# EAGLE design Laser Centraal (EAGLE 9.3.2)
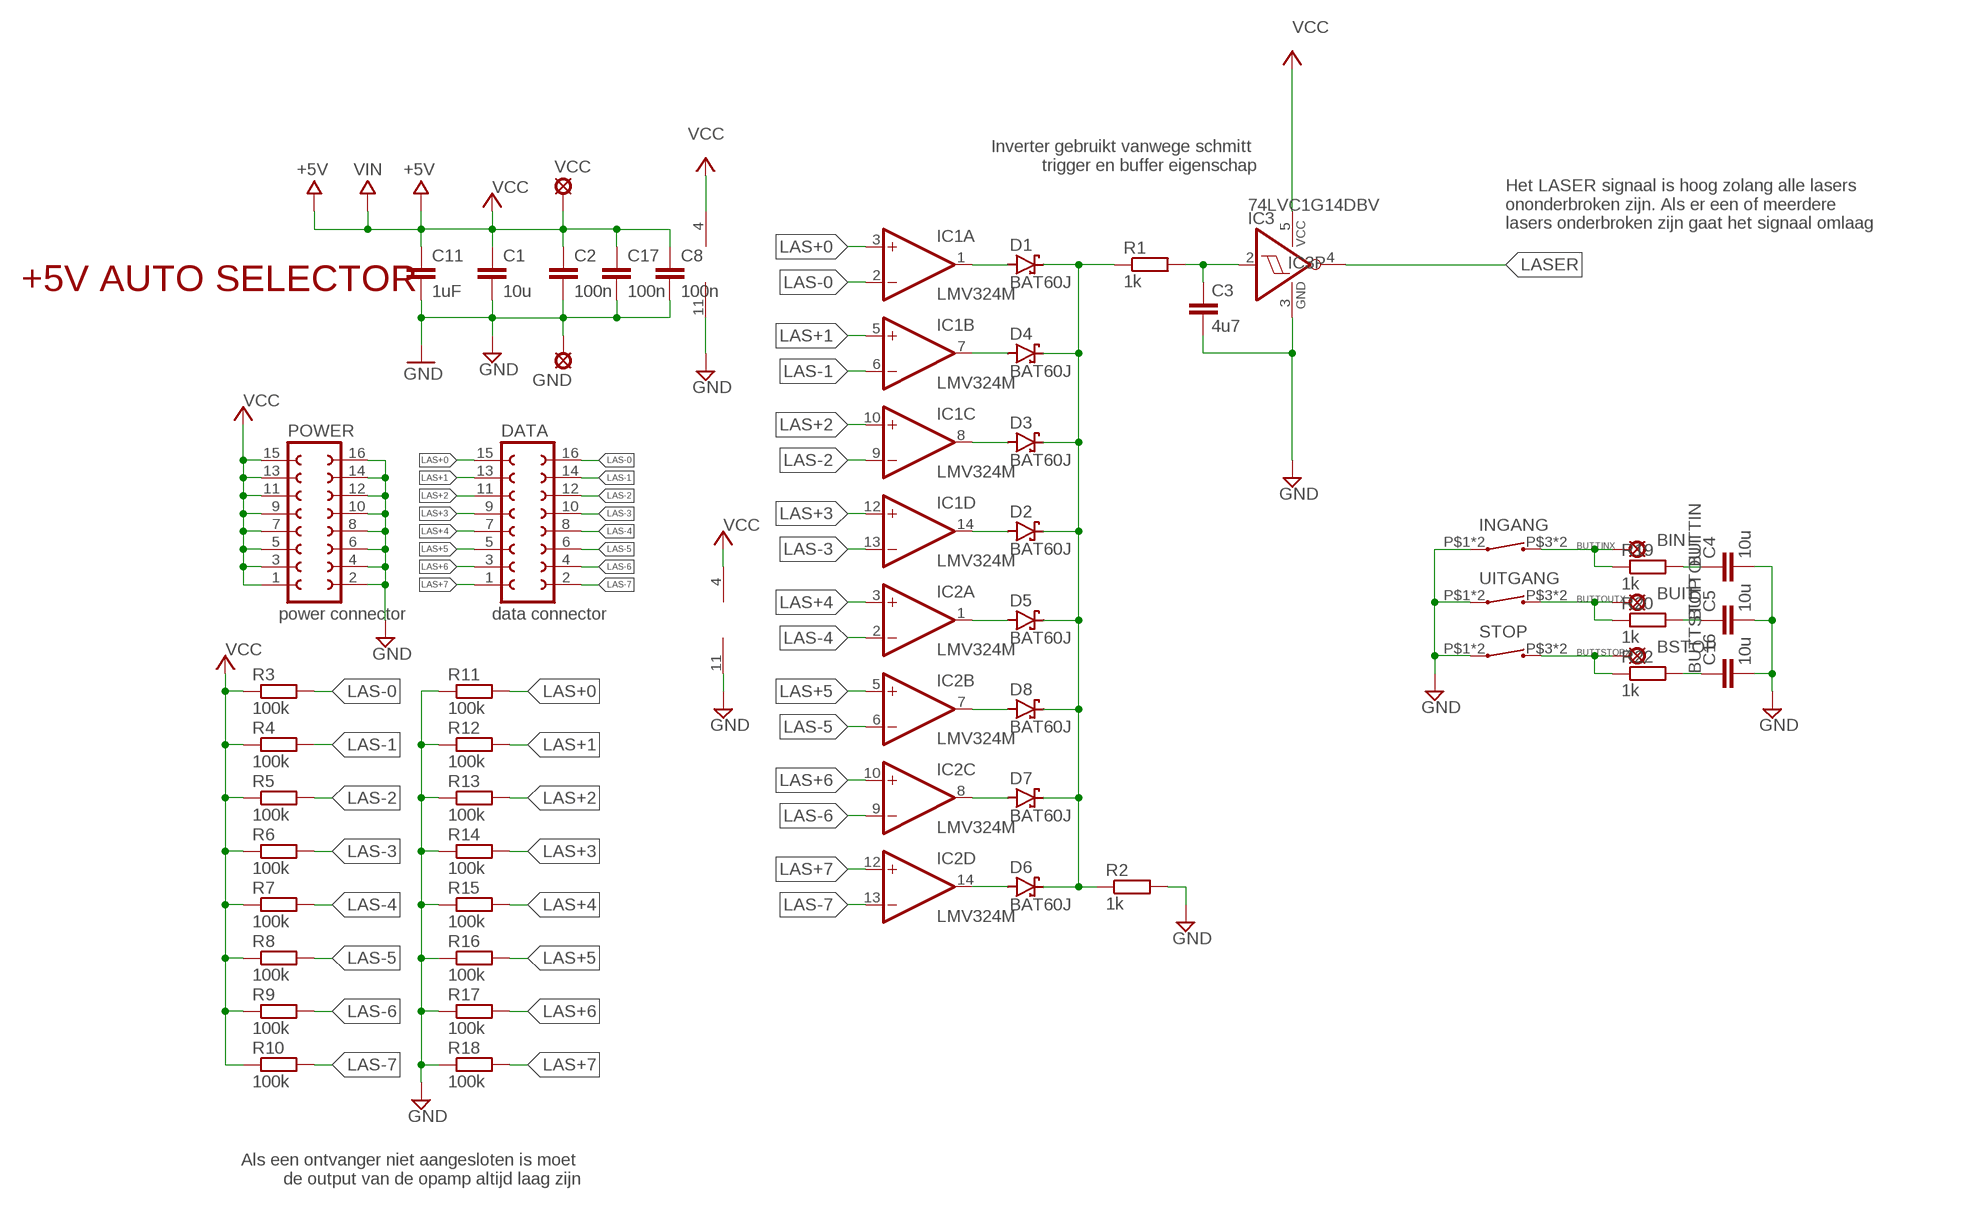
[diagram p0: schematic, sheet 1, part 1 of 2]
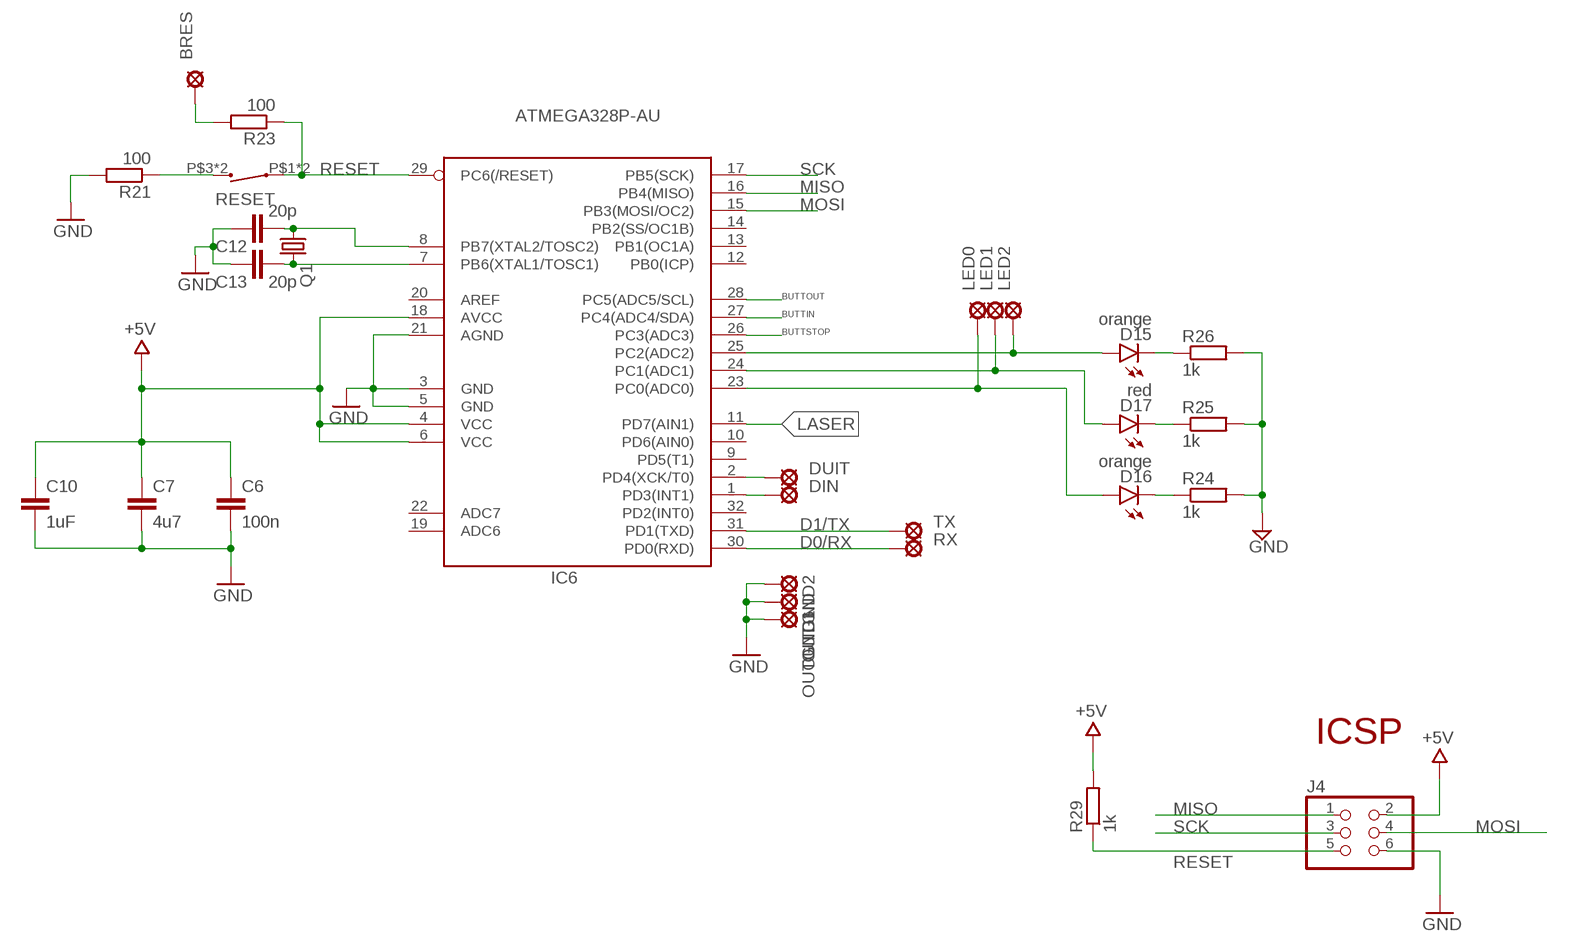
[diagram p1: schematic, sheet 1, part 2 of 2]

## Parts
BIN  LSP10  [LSP10]
BRES  LSP10  [LSP10]
BSTOP  LSP10  [LSP10]
BUIT  LSP10  [LSP10]
C1  10u  C-EUC0805  [C0805]
C2  100n  C-EUC0805  [C0805]
C3  4u7  C-EUC0805  [C0805]
C4  10u  C-EUC0805  [C0805]
C5  10u  C-EUC0805  [C0805]
C6  100n  C-EUC0805  [C0805]
C7  4u7  C-EUC0805  [C0805]
C8  100n  C-EUC0805  [C0805]
C10  1uF  C-EUC0805  [C0805]
C11  1uF  C-EUC0805  [C0805]
C12  20p  C-EUC0805  [C0805]
C13  20p  C-EUC0805  [C0805]
C16  10u  C-EUC0805  [C0805]
C17  100n  C-EUC0805  [C0805]
D1  BAT60J  [SOD323_ST]
D2  BAT60J  [SOD323_ST]
D3  BAT60J  [SOD323_ST]
D4  BAT60J  [SOD323_ST]
D5  BAT60J  [SOD323_ST]
D6  BAT60J  [SOD323_ST]
D7  BAT60J  [SOD323_ST]
D8  BAT60J  [SOD323_ST]
D15  orange  LEDCHIP-LED0805  [CHIP-LED0805]
D16  orange  LEDCHIP-LED0805  [CHIP-LED0805]
D17  red  LEDCHIP-LED0805  [CHIP-LED0805]
DATA  FE08-2  [FE08-2]
DIN  LSP10  [LSP10]
DUIT  LSP10  [LSP10]
GND  LSP10  [LSP10]
IC1  LMV324M  [SO14]
IC2  LMV324M  [SO14]
IC3  74LVC1G14DBV  [SOT23-5]
IC6  ATMEGA328P-AU  ATMEGA328P-32AU  [TQFP32-08]
INGANG  BRIGHTTSA061G100-250_SWITCH  [BRIGHTTSA061G100-250]
J4  0114_PH254-203DF118A00V  [2X03]
LED0  LSP10  [LSP10]
LED1  LSP10  [LSP10]
LED2  LSP10  [LSP10]
OUTGND  LSP10  [LSP10]
OUTGND1  LSP10  [LSP10]
OUTGND2  LSP10  [LSP10]
POWER  FE08-2  [FE08-2]
Q1  CRYSTALHC49U70  [HC49U70]
R1  1k  R-EU_R0805  [R0805]
R2  1k  R-EU_R0805  [R0805]
R3  100k  R-EU_R0805  [R0805]
R4  100k  R-EU_R0805  [R0805]
R5  100k  R-EU_R0805  [R0805]
R6  100k  R-EU_R0805  [R0805]
R7  100k  R-EU_R0805  [R0805]
R8  100k  R-EU_R0805  [R0805]
R9  100k  R-EU_R0805  [R0805]
R10  100k  R-EU_R0805  [R0805]
R11  100k  R-EU_R0805  [R0805]
R12  100k  R-EU_R0805  [R0805]
R13  100k  R-EU_R0805  [R0805]
R14  100k  R-EU_R0805  [R0805]
R15  100k  R-EU_R0805  [R0805]
R16  100k  R-EU_R0805  [R0805]
R17  100k  R-EU_R0805  [R0805]
R18  100k  R-EU_R0805  [R0805]
R19  1k  R-EU_R0805  [R0805]
R20  1k  R-EU_R0805  [R0805]
R21  100  R-EU_R0805  [R0805]
R22  1k  R-EU_R0805  [R0805]
R23  100  R-EU_R0805  [R0805]
R24  1k  R-EU_R0805  [R0805]
R25  1k  R-EU_R0805  [R0805]
R26  1k  R-EU_R0805  [R0805]
R29  1k  R-EU_R0805  [R0805]
RESET  BRIGHTTSA061G100-250_SWITCH  [BRIGHTTSA061G100-250]
RX  LSP10  [LSP10]
STOP  BRIGHTTSA061G100-250_SWITCH  [BRIGHTTSA061G100-250]
TX  LSP10  [LSP10]
UITGANG  BRIGHTTSA061G100-250_SWITCH  [BRIGHTTSA061G100-250]
VCC  LSP10  [LSP10]

## Nets
BUTTIN: C4.1 IC6.27(PC4(ADC4/SDA)) R19.2
BUTTINX: BIN.MP INGANG.P$3 INGANG.P$4 R19.1
BUTTOUT: C5.1 IC6.28(PC5(ADC5/SCL)) R20.2
BUTTOUTX: BUIT.MP R20.1 UITGANG.P$3 UITGANG.P$4
BUTTSTOP: C16.1 IC6.26(PC3(ADC3)) R22.2
BUTTSTOPX: BSTOP.MP R22.1 STOP.P$3 STOP.P$4
D0/RX: IC6.30(PD0(RXD)) RX.MP
D1/TX: IC6.31(PD1(TXD)) TX.MP
GND: C1.2 C2.2 C3.2 C4.2 C5.2 C6.2 C7.2 C8.2 C10.2 C11.2 C12.1 C13.1 C16.2 C17.2 GND.MP IC1.11(P:V-) IC2.11(P:V-) IC3.3(GND) IC6.3(GND) IC6.5(GND) IC6.21(AGND) INGANG.P$1 INGANG.P$2 J4.6 OUTGND1.MP OUTGND2.MP OUTGND.MP POWER.2 POWER.4 POWER.6 POWER.8 POWER.10 POWER.12 POWER.14 POWER.16 R2.2 R11.1 R12.1 R13.1 R14.1 R15.1 R16.1 R17.1 R18.1 R21.2 R24.2 R25.2 R26.2 STOP.P$1 STOP.P$2 UITGANG.P$1 UITGANG.P$2
LAS+0: DATA.15 IC1.3(A:+IN) R11.2
LAS+1: DATA.13 IC1.5(B:+IN) R12.2
LAS+2: DATA.11 IC1.10(C:+IN) R13.2
LAS+3: DATA.9 IC1.12(D:+IN) R14.2
LAS+4: DATA.7 IC2.3(A:+IN) R15.2
LAS+5: DATA.5 IC2.5(B:+IN) R16.2
LAS+6: DATA.3 IC2.10(C:+IN) R17.2
LAS+7: DATA.1 IC2.12(D:+IN) R18.2
LAS-0: DATA.16 IC1.2(A:-IN) R3.2
LAS-1: DATA.14 IC1.6(B:-IN) R4.2
LAS-2: DATA.12 IC1.9(C:-IN) R5.2
LAS-3: DATA.10 IC1.13(D:-IN) R6.2
LAS-4: DATA.8 IC2.2(A:-IN) R7.2
LAS-5: DATA.6 IC2.6(B:-IN) R8.2
LAS-6: DATA.4 IC2.9(C:-IN) R9.2
LAS-7: DATA.2 IC2.13(D:-IN) R10.2
LASER: IC3.4(O) IC6.11(PD7(AIN1))
MISO [small]: IC6.16(PB4(MISO)) J4.1
MOSI [small]: IC6.15(PB3(MOSI/OC2)) J4.4
N$1: D1.A IC1.1(A:OUT)
N$2: D4.A IC1.7(B:OUT)
N$3: D3.A IC1.8(C:OUT)
N$4: D2.A IC1.14(D:OUT)
N$5: D5.A IC2.1(A:OUT)
N$6: D8.A IC2.7(B:OUT)
N$7: D7.A IC2.8(C:OUT)
N$8: D6.A IC2.14(D:OUT)
N$9: D1.C D2.C D3.C D4.C D5.C D6.C D7.C D8.C R1.1 R2.1
N$10: C3.1 IC3.2(I) R1.2
N$11: C13.2 IC6.7(PB6(XTAL1/TOSC1)) Q1.2
N$12: D16.C R24.1
N$13: D17.A IC6.24(PC1(ADC1)) LED1.MP
N$14: D15.C R26.1
N$15: R21.1 RESET.P$3 RESET.P$4
N$16: D16.A IC6.23(PC0(ADC0)) LED0.MP
N$17: C12.2 IC6.8(PB7(XTAL2/TOSC2)) Q1.1
N$18: BRES.MP R23.2
N$20: DUIT.MP IC6.2(PD4(XCK/T0))
N$21: D17.C R25.1
N$22: D15.A IC6.25(PC2(ADC2)) LED2.MP
N$23: DIN.MP IC6.1(PD3(INT1))
RESET: IC6.29(PC6(/RESET)) J4.5 R23.1 R29.1 RESET.P$1 RESET.P$2
SCK [small]: IC6.17(PB5(SCK)) J4.3
VCC: C1.1 C2.1 C6.1 C7.1 C8.1 C10.1 C11.1 C17.1 IC1.4(P:V+) IC2.4(P:V+) IC3.5(VCC) IC6.4(VCC) IC6.6(VCC) IC6.18(AVCC) J4.2 POWER.1 POWER.3 POWER.5 POWER.7 POWER.9 POWER.11 POWER.13 POWER.15 R3.1 R4.1 R5.1 R6.1 R7.1 R8.1 R9.1 R10.1 R29.2 VCC.MP ; supply symbol labelled +5V, VIN
Unconnected: IC6.9(PD5(T1)) IC6.10(PD6(AIN0)) IC6.12(PB0(ICP)) IC6.13(PB1(OC1A)) IC6.14(PB2(SS/OC1B)) IC6.19(ADC6) IC6.20(AREF) IC6.22(ADC7) IC6.32(PD2(INT0))

## Notes on the sheet
- Inverter gebruikt vanwege schmitt 
  trigger en buffer eigenschap
- Het LASER signaal is hoog zolang alle lasers 
  ononderbroken zijn. Als er een of meerdere 
  lasers onderbroken zijn gaat het signaal omlaag
- +5V AUTO SELECTOR
- power connector | data connector
- ICSP
- Als een ontvanger niet aangesloten is moet 
  de output van de opamp altijd laag zijn

## Library data of the parts
BIN BRES BSTOP BUIT DIN DUIT GND LED0 LED1 LED2 OUTGND OUTGND1 OUTGND2 RX TX VCC = solpad:LSP10: SOLDER PAD drill 1.0 mm, distributor Buerklin, 12H555
C1 C2 C6-C8 C10-C13 C17 = rcl:C-EU: CAPACITOR, European symbol; SPICEPREFIX: C
C3-C5 C16 = resistor:C-EU: CAPACITOR, European symbol
D1-D8 = diode:BAT60J: Schottky barrier diode Source: www.st.com, BAT60J.pdf
D15-D17 = led:LED: LED OSRAM: - CHIPLED LG R971, LG N971, LY N971, LG Q971, LY Q971, LO R971, LY R971 LH N974, LH R974 LS Q976, LO Q976, LY Q976 LO Q996 - Hyper CHIPLED LW Q18S LB Q993, LB Q99A, LB R99A - SideLED LS A670, LO A670, LY A670, LG A670, LP A670 LB A673, LV A673, LT A673, LW A673 LH A674 LY A675 LS A676, LA A676, LO A676, LY A676, LW A676 LS A679, LY A679, LG A679 - Hyper Micro SIDELED® LS Y876, LA Y876, LO Y876, LY Y876 LT Y87S - SmartLED LW L88C, LW L88S LB L89C, LB L89S, LG L890 LS L89K, LO L89K, LY L89K LS L896, LA L896, LO L896, LY L896 - TOPLED LS T670, LO T670, LY T670, LG T670, LP T670 LSG T670, LSP T670, LSY T670, LOP T670, LYG T670 LG T671, LOG T671, LSG T671 LB T673, LV T673, LT T673, LW T673 LH T674 LS T676, LA T676, LO T676, LY T676, LB T676, LH T676, LSB T676, LW T676 LB T67C, LV T67C, LT T67C, LS T67K, LO T67K, LY T67K, LW E67C LS E67B, LA E67B, LO E67B, LY E67B, LB E67C, LV E67C, LT E67C LW T67C LS T679, LY T679, LG T679 LS T770, LO T770, LY T770, LG T770, LP T770 LB T773, LV T773, LT T773, LW T773 LH T774 LS E675, LA E675, LY E675, LS T675 LS T776, LA T776, LO T776, LY T776, LB T776 LHGB T686 LT T68C, LB T68C - Hyper Mini TOPLED® LB M676 - Mini TOPLED Santana® LG M470 LS M47K, LO M47K, LY M47K Source: http://www.osram.convergy.de LUXEON: - LUMILED® LXK2-PW12-R00, LXK2-PW12-S00, LXK2-PW14-U00, LXK2-PW14-V00 LXK2-PM12-R00, LXK2-PM12-S00, LXK2-PM14-U00 LXK2-PE12-Q00, LXK2-PE12-R00, LXK2-PE12-S00, LXK2-PE14-T00, LXK2-PE14-U00 LXK2-PB12-K00, LXK2-PB12-L00, LXK2-PB12-M00, LXK2-PB14-N00, LXK2-PB14-P00, LXK2-PB14-Q00 LXK2-PR12-L00, LXK2-PR12-M00, LXK2-PR14-Q00, LXK2-PR14-R00 LXK2-PD12-Q00, LXK2-PD12-R00, LXK2-PD12-S00 LXK2-PH12-R00, LXK2-PH12-S00 LXK2-PL12-P00, LXK2-PL12-Q00, LXK2-PL12-R00 Source: www.luxeon.com KINGBRIGHT: KA-3528ASYC Source: www.kingbright.com
DATA = header:FE08-2: FEMALE HEADER; OC_FARNELL: unknown; OC_NEWARK: unknown
IC1 IC2 = linear:LMV324?*: Quad General Purpose, Low Voltage, Rail-to-Rail Output Operational Amplifiers Source: http://www.national.com/mpf/LM/LMV321.html http://www.national.com/dt/lmv_qual.pdf
IC3 = 74xx-little-de:74*1G14: Single Schmitt-Trigger Inverter Gate
IC6 = Arduino-ucs&SoCs:ATMEGA328P-32: 8-bit Microcontroller with 32KBytes In-System Programmable Flash ATMEGA328P-AU; DATASHEET: http://www.atmel.com/images/Atmel-8271-8-bit-AVR-Microcontroller-ATmega48A-48PA-88A-88PA-168A-168PA-328-328P_datasheet_Complete.pdf; DISTRIBUTOR-LINK: https://www.digikey.it/product-detail/it/microchip-technology/ATMEGA328P-AU/ATMEGA328P-AU-ND/1832260; DISTRIBUTOR-PN: ATMEGA328P-AU-ND; MANUFACTURER: ATMEL; MANUFACTURER-PN: ATMEGA328P-AU
INGANG RESET STOP UITGANG = switch BRIGHT TSA061G100-250lbr:BRIGHTTSA061G100-250_SWITCH
J4 = Connettori:0114_PH254-203DF118A00V: 3x2 M V h 8,5 mm p2,54; MONTHLY_USAGE: _____; PART_NUMBER: PH254-203DF118A00V; PRICE: _____; SUPPLIER: _____; TYPE: Connettori; VALUE: ICSP
POWER = header:FE08-2: FEMALE HEADER; OC_FARNELL: unknown; OC_NEWARK: unknown; SPICEPREFIX: X
Q1 = crystal:CRYSTAL: CRYSTAL; OC_FARNELL: unknown; OC_NEWARK: unknown
R1-R26 R29 = rcl:R-EU_: RESISTOR, European symbol; SPICEPREFIX: R

## Net classes
0 default: width 0.152 mm
1 small: width 0.152 mm

## Board
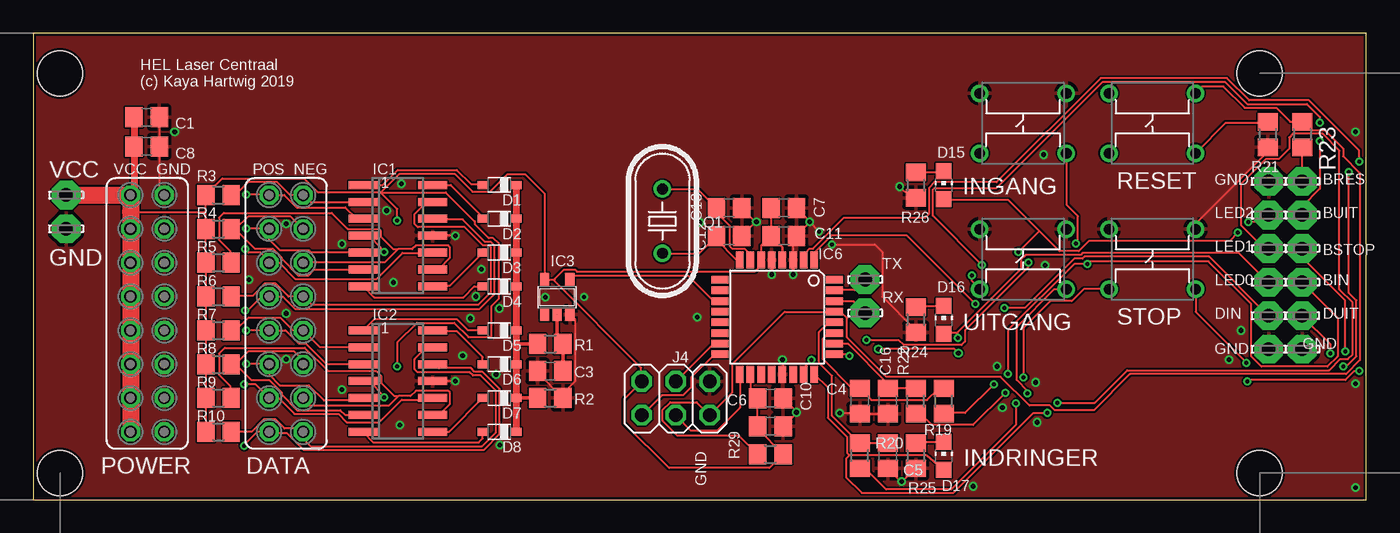
[diagram p2: board, top side]
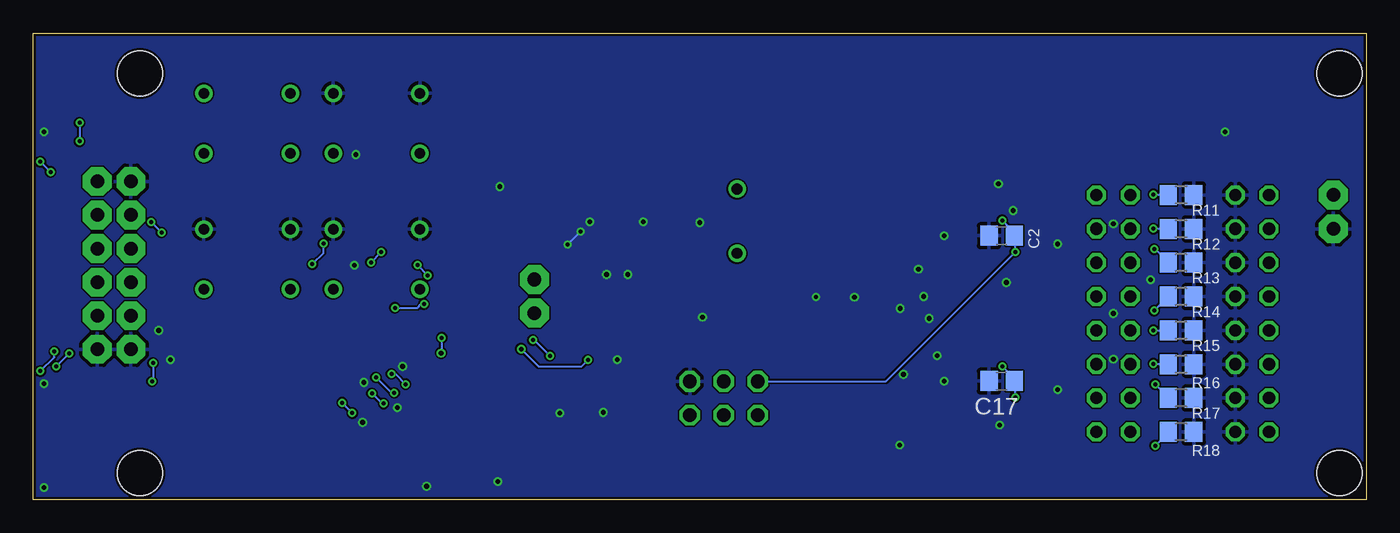
[diagram p3: board, bottom side, seen from below]

Size 100 x 35 mm. Coordinates in mm from the lower left corner, seen from the top.
Outline: 0,0 100,0 100,35 0,35 0,0
Copper layers (1*16): Top 0.035mm / dielectric 1.5mm / Bottom 0.035mm
Design rules "default": minimum track width 5mil, minimum drill 0.3mm, track to track 5mil, track to pad 5mil, pad to pad 5mil, via to via 5mil, smd to smd 5mil, copper to edge 0.2mm, drill to drill 6mil, minimum pad ring 10mil, minimum via ring 0.15mm, stop-mask expansion 4mil, vias tented up to drill 0mil, thermal gap 10mil
Holes 3.4 mm at 2,2 2,32 92,2 92,32

### Footprints (pad centres in the part's own frame; a part is rotated, then mirrored left to right if it is on the bottom)
LSP10 = drill 1.016 pad 2.159 octagon: MP 0,0
C0805 = smd 1.3 x 1.5: 1 -0.95,0; 2 0.95,0
SOD323_ST = smd 0.8 x 0.6: A 1.25,0; C -1.25,0
CHIP-LED0805 = smd 1.2 x 1.2: A 0,-1.05; C 0,1.05
FE08-2 = drill 0.914 octagon: 1 -8.89,1.27; 2 -8.89,-1.27; 3 -6.35,1.27; 4 -6.35,-1.27; 5 -3.81,1.27; 6 -3.81,-1.27; 7 -1.27,1.27; 8 -1.27,-1.27; 9 1.27,1.27; 10 1.27,-1.27; 11 3.81,1.27; 12 3.81,-1.27; 13 6.35,1.27; 14 6.35,-1.27; 15 8.89,1.27; 16 8.89,-1.27
SO14 = smd 0.6 x 2.2: 1 -3.81,-2.6; 2 -2.54,-2.6; 3 -1.27,-2.6; 4 0,-2.6; 5 1.27,-2.6; 6 2.54,-2.6; 7 3.81,-2.6; 8 3.81,2.6; 9 2.54,2.6; 10 1.27,2.6; 11 0,2.6; 12 -1.27,2.6; 13 -2.54,2.6; 14 -3.81,2.6
SOT23-5 = smd 0.69 x 0.99: 1 -0.95,-1.29; 2 0,-1.29; 3 0.95,-1.29; 4 0.95,1.3; 5 -0.95,1.3
TQFP32-08 = smd 1.27 x 0.559: 1 -4.293,2.8; 2 -4.293,2; 3 -4.293,1.2; 4 -4.293,0.4; 5 -4.293,-0.4; 6 -4.293,-1.2; 7 -4.293,-2; 8 -4.293,-2.8; 17 4.293,-2.8; 18 4.293,-2; 19 4.293,-1.2; 20 4.293,-0.4; 21 4.293,0.4; 22 4.293,1.2; 23 4.293,2; 24 4.293,2.8 | smd 0.559 x 1.27: 9 -2.8,-4.293; 10 -2,-4.293; 11 -1.2,-4.293; 12 -0.4,-4.293; 13 0.4,-4.293; 14 1.2,-4.293; 15 2,-4.293; 16 2.8,-4.293; 25 2.8,4.293; 26 2,4.293; 27 1.2,4.293; 28 0.4,4.293; 29 -0.4,4.293; 30 -1.2,4.293; 31 -2,4.293; 32 -2.8,4.293
BRIGHTTSA061G100-250 = drill 0.8: P$1 0,0; P$2 6.5,0; P$3 0,-4.5; P$4 6.5,-4.5
2X03 = drill 1.016 pad 1.55 octagon: 1 -2.54,-1.27; 2 -2.54,1.27; 3 0,-1.27; 4 0,1.27; 5 2.54,-1.27; 6 2.54,1.27
HC49U70 = drill 0.813: 1 -2.413,0; 2 2.413,0
R0805 = smd 1.3 x 1.5: 1 -0.95,0; 2 0.95,0

### Placement (x,y rotation side)
BIN  95.2,16.32 0 top
BRES  95.2,23.88 0 top
BSTOP  95.2,18.84 0 top
BUIT  95.2,21.36 0 top
C1  8.5,28.7 0 top
C2  27.35,19.81 180 bottom
C3  38.78,9.65 180 top
C4  62,7.4 270 top
C5  64.1,3.3 270 top
C6  55.3,7.6 0 top
C7  56.3,21.9 0 top
C8  8.5,26.5 0 top
C10  55.3,5.5 0 top
C11  56.3,19.8 0 top
C12  52.2,19.8 180 top
C13  52.2,21.9 180 top
C16  64.1,7.4 270 top
C17  27.35,8.89 180 bottom
D1  34.97,23.62 180 top
D2  34.97,21.08 180 top
D3  34.97,18.54 180 top
D4  34.97,16 180 top
D5  34.97,12.7 180 top
D6  34.97,10.16 180 top
D7  34.97,7.62 180 top
D8  34.97,5.08 180 top
D15  68.3,23.6 0 top
D16  68.3,13.5 0 top
D17  68.3,3.3 0 top
DATA  18.97,13.97 90 top
DIN  92.68,13.8 0 top
DUIT  95.2,13.8 180 top
GND  2.46,20.32 0 top
IC1  27.35,19.81 270 top
IC2  27.35,8.89 270 top
IC3  39.3,15.2 0 top
IC6  55.8,13.7 270 top
INGANG  71,30.5 0 top
J4  48.2,7.6 0 top
LED0  92.68,16.32 0 top
LED1  92.68,18.84 0 top
LED2  92.68,21.36 0 top
OUTGND  92.68,11.28 0 top
OUTGND1  95.2,11.28 0 top
OUTGND2  92.68,23.88 0 top
POWER  8.56,13.97 90 top
Q1  47.2,20.9 90 top
R1  38.78,11.68 0 top
R2  38.78,7.62 0 top
R3  13.89,22.86 0 top
R4  13.89,20.32 0 top
R5  13.89,17.78 0 top
R6  13.89,15.24 0 top
R7  13.89,12.7 0 top
R8  13.89,10.16 0 top
R9  13.89,7.62 0 top
R10  13.89,5.08 0 top
R11  13.89,22.86 180 bottom
R12  13.89,20.32 180 bottom
R13  13.89,17.78 180 bottom
R14  13.89,15.24 180 bottom
R15  13.89,12.7 180 bottom
R16  13.89,10.16 180 bottom
R17  13.89,7.62 180 bottom
R18  13.89,5.08 180 bottom
R19  68.3,7.4 90 top
R20  62,3.3 90 top
R21  92.6,27.4 270 top
R22  66.2,7.4 90 top
R23  95.2,27.4 270 top
R24  66.2,13.5 270 top
R25  66.2,3.3 270 top
R26  66.2,23.6 270 top
R29  55.3,3.4 0 top
RESET  80.7,30.5 0 top
RX  62.4,14 0 top
STOP  80.7,20.3 0 top
TX  62.4,16.52 0 top
UITGANG  71,20.3 0 top
VCC  2.46,22.86 0 top

### Tracks (layer width: path | path; a pad name or v marks a point on that pad's centre or on a via)
BUTTIN
  Top 0.152: IC6.27 60.07,12.43 59.58,12.43 59.23,12.08 59.23,10.55 61.4,8.38 61.96,8.38 C4.1 62.03,8.31 62.87,7.47 67.06,7.47 67.89,8.31 68.24,8.31 R19.2
BUTTINX  (via drill 0.3)
  Top 0.152: v72.06,8.66 69.9,6.5 68.31,6.5 R19.1 | v73.13,9.43 73.13,12.71 78.09,17.67 v79.07,17.67 79.27,17.87 88.16,17.87 91.36,14.67 91.36,10.76 92.13,9.99 97.09,9.99 97.86,10.76 97.86,13.62 95.21,16.27 BIN.MP | v78.23,19.21 78.37,19.35 78.37,21.28 77.53,22.11 77.53,25.98 INGANG.P$4
  Bottom 0.152: v73.13,9.43 72.83,9.43 v72.06,8.66 | v78.23,19.21 78.23,18.51 v79.07,17.67
BUTTOUT
  Top 0.152: IC6.28 60.07,13.27 59.65,13.27 58.95,12.57 58.95,10.27 59.93,9.29 59.93,6.29 61.96,4.26 R20.2 62.03,4.26 64.05,4.26 C5.1
BUTTOUTX  (via drill 0.3)
  Top 0.152: v73.72,7.2 73.72,5.62 68.87,0.77 63.98,0.77 62.45,2.31 62.03,2.31 R20.1 | v96.53,26.89 96.53,23.33 95.21,22 95.21,21.37 BUIT.MP | v96.53,28.29 96.53,28.71 95.56,29.69 91.07,29.69 89.39,31.36 80.23,31.36 72.27,23.4 67.61,23.4 67.47,23.26 67.47,21.3 v71.18,17.6 | v70.41,16.83 70.41,16.41 70.97,15.86 UITGANG.P$3 | v74.59,7.97 74.59,8.16 73.79,8.96 73.79,12.97 76.61,15.8 UITGANG.P$4
  Bottom 0.152: v74.59,7.97 73.82,7.2 v73.72,7.2 | v96.53,28.29 v96.53,26.89 | v70.41,16.83 v71.18,17.6
BUTTSTOP
  Top 0.152: IC6.26 60.14,11.66 61.15,11.66 64.05,8.76 64.05,8.38 C16.1 64.12,8.38 66.15,8.38 R22.2
BUTTSTOPX  (via drill 0.3)
  Top 0.152: v72.92,8 70.51,5.59 67.41,5.59 66.57,6.43 66.22,6.43 R22.1 | STOP.P$3 78.8,15.8 77.9,14.9 76.32,14.9 74.29,12.87 v74.29,9.17 | v98.42,11.11 98.42,14.95 95.21,18.16 95.21,18.79 BSTOP.MP | v99.47,9.64 99.12,9.64 98.45,8.97 91.19,8.97 v91.09,8.87 | STOP.P$4 87.2,14.1 91.03,10.28 v91.03,10.24
  Bottom 0.152: v74.29,9.17 73.12,8 v72.92,8 | v98.42,11.11 98.42,10.69 v99.47,9.64 | v91.09,8.87 91.03,8.94 v91.03,10.24
D0/RX
  Top 0.152: IC6.30 60.14,14.88 61.54,14.88 62.38,14.04 RX.MP
D1/TX
  Top 0.152: IC6.31 60.14,15.72 61.61,15.72 62.38,16.48 TX.MP
GND  (via drill 0.3, 0.35)
  Top 0.152: C3.2 37.86,9.64 37.86,9.5 39.67,7.68 R2.2 39.6,7.82 40.65,8.87 40.65,13.55 40.3,13.9 IC3.3 | C1.2 9.43,28.64 9.43,26.54 C8.2 9.5,26.47 9.5,23.19 9.78,22.91 POWER.16 | 57,17.95 v57,16.9 | 57,17.95 IC6.3 | IC6.21 56.23,9.43 56.23,10.48 v56.2,10.5 | IC6.5 55.46,17.95 55.46,16.9 v55.4,16.9 | C10.2 56.3,5.52 57.28,6.5 v57.25,6.55 57.28,6.57 56.3,7.54 C6.2 | C5.2 64.12,2.31 65.1,1.33 v65.15,1.35 65.17,1.33 66.15,2.31 R25.2 | v60.5,6.5 60.56,6.5 61.96,6.5 C4.2 62.03,6.43 64.05,6.43 C16.2 | v59.92,19.15 63.13,19.15 63.7,18.58 63.7,15.23 66.15,12.78 66.15,12.57 R24.2 | 58.26,20.82 v58.95,20.12 | C12.1 53.16,19.84 54.2,20.89 v54.25,20.85 54.13,20.89 53.16,21.86 C13.1 | 58.26,20.82 57.28,19.84 C11.2 57,19.55 57,17.95 | 58.26,20.82 v58.25,20.85 58.26,20.89 57.28,21.86 C7.2 | R26.2 66.15,22.7 65.8,22.7 65.03,23.47 v65,23.5 | R21.2 92.55,26.4 92.55,26.05 87.24,20.75 87.24,20.33 STOP.P$2 | IC2.11 29.97,8.87 31.64,8.87 v31.67,8.89 | IC1.11 29.97,19.84 31.64,19.84 v31.67,19.81
  Bottom 0.152: v58.95,20.12 v59.92,19.15
  other vias: 41.3,15.2 16.18,16.51 33.19,15.24 18.97,20.7 23.16,19.18 18.97,10.54 23.16,8.26 34.72,9.4 18.97,13.97 34.97,14.35 38.4,15.2 75.8,25.9 70.5,1 75.3,5.8 99.2,8.7 99.2,0.9 72.7,6.9 75.2,8.8 89.7,10.5 90.6,12.7 50,20.8 75.9,17.6 72.3,10 99.2,27.6 10.6,27.6 49.8,13.7 35,4.1 27.6,23.7 27.5,5.6 32.2,10.8 32.8,13.6 26.5,21.7 33.6,17.3 27,16.3
  pour Bottom: -5.41,53.91 109.55,53.91 109.55,-3.05 -5.41,-3.05
  pour Top: -7,42 -7,-8 107,-8 107,42
LAS+0  (via drill 0.3)
  Top 0.152: v15.97,22.91 17.64,22.91 DATA.15 18.84,22.86 19.76,21.93 23.4,21.93 24.24,21.09 24.69,21.09 IC1.3
  Bottom 0.152: v15.97,22.91 14.85,22.91 R11.2
LAS+1  (via drill 0.3)
  Top 0.152: v15.97,20.33 17.61,20.33 DATA.13 17.7,19.51 18.49,18.71 20.65,18.71 20.79,18.58 24.69,18.58 IC1.5
  Bottom 0.152: v15.97,20.33 14.85,20.33 R12.2
LAS+2  (via drill 0.3)
  Top 0.152: v15.9,18.79 16.15,18.54 17.05,18.54 17.7,17.88 DATA.11 18.44,17.78 19.66,16.55 25.75,16.55 27.7,18.51 29.93,18.51 IC1.10
  Bottom 0.152: v15.9,18.79 15.83,18.79 14.85,17.81 R13.2
LAS+3  (via drill 0.3)
  Top 0.152: v15.9,14.18 16.09,14.18 17.15,15.24 DATA.9 18.72,15.24 19.64,14.32 33.5,14.32 34.62,15.44 34.62,19.07 34.34,19.35 33.89,19.35 32.21,21.02 30,21.02 IC1.12
  Bottom 0.152: v15.9,14.18 R14.2
LAS+4  (via drill 0.3)
  Top 0.152: v15.97,12.71 17.66,12.71 DATA.7 18.93,12.7 19.89,11.73 20.44,11.73 21.97,10.2 24.7,10.2 IC2.3
  Bottom 0.152: v15.97,12.71 R15.2
LAS+5  (via drill 0.3)
  Top 0.152: v15.97,10.2 17.64,10.2 DATA.5 17.7,9.38 18.49,8.59 20.66,8.59 21.82,7.43 24.56,7.43 IC2.5
  Bottom 0.152: v15.97,10.2 14.85,10.2 R16.2
LAS+6  (via drill 0.3)
  Top 0.152: v15.83,8.66 16.67,8.66 17.64,7.68 DATA.3 18.4,7.62 19.59,6.43 22.89,6.43 23.52,5.8 25.95,5.8 27.64,7.49 29.62,7.49 IC2.10
  Bottom 0.152: v15.83,8.66 14.85,7.68 R17.2
LAS+7  (via drill 0.3)
  Top 0.152: v15.83,4.05 15.83,4.1 16.81,5.08 DATA.1 17.83,4.95 19.06,4.95 20.28,3.73 33.8,3.73 35,4.92 35,8.3 33.7,9.6 33.12,9.6 32.84,9.87 30.44,9.87 IC2.12
  Bottom 0.152: v15.83,4.05 14.85,5.03 R18.2
LAS-0
  Top 0.152: R3.2 14.85,22.91 15.2,22.91 16.11,23.82 18.3,23.82 19.26,22.86 DATA.16 20.3,22.84 20.79,22.35 IC1.2
LAS-1
  Top 0.152: DATA.14 20.23,20.33 19.32,21.23 16.11,21.23 15.2,20.33 R4.2 15.2,20.26 16.61,18.84 17.94,18.84 18.62,18.16 18.62,18.09 19.88,16.83 20.65,16.83 21.07,17.25 24.7,17.25 IC1.6
LAS-2
  Top 0.152: R5.2 14.78,17.81 14.78,18.65 13.94,19.49 13.94,21.16 14.29,21.51 22.39,21.51 23.59,20.32 25.94,20.32 26.05,20.2 26.05,19.75 27.01,18.79 27.35,18.79 | IC1.9 30.01,17.32 30.43,17.32 31.26,18.16 31.26,18.93 31.12,19.07 28.7,19.07 28.43,18.79 27.35,18.79 | DATA.12 20.3,17.81 26.37,17.81 27.35,18.79
LAS-3
  Top 0.152: R6.2 14.85,15.3 16.45,15.3 17.36,16.2 18.18,16.2 19.14,15.24 DATA.10 20.3,15.23 20.88,14.65 33.41,14.65 34.34,15.58 34.34,18.93 34.2,19.07 33.75,19.07 32.36,20.45 28.83,20.45 28.61,20.68 28.61,21.44 29.52,22.35 IC1.13
LAS-4
  Top 0.152: R7.2 14.85,12.71 15.2,12.71 16.11,13.62 18.56,13.62 19.48,12.7 DATA.8 21.48,11.46 24.7,11.46 IC2.2
LAS-5
  Top 0.152: DATA.6 20.24,10.44 19.57,11.11 16.11,11.11 15.2,10.2 14.85,10.2 R8.2 15.2,10.13 16.36,8.97 17.69,8.97 18.62,8.03 18.62,7.89 19.81,6.71 23.03,6.71 23.38,6.36 24.7,6.36 IC2.6
LAS-6
  Top 0.152: R9.2 14.78,7.68 14.78,8.52 13.94,9.36 13.94,10.97 14.36,11.39 20.37,11.39 22.1,9.65 25.7,9.65 26.08,9.27 26.08,8.76 27.08,7.77 27.4,7.77 | IC2.9 30,6.36 30.43,6.36 31.26,7.2 31.26,8.03 31.12,8.17 28.7,8.17 28.3,7.77 27.4,7.77 | DATA.4 20.24,7.44 20.63,7.05 26.69,7.05 27.4,7.77
LAS-7
  Top 0.152: R10.2 14.85,5.1 16.39,5.1 17.29,6.01 18.18,6.01 18.85,5.33 19.99,5.33 DATA.2 20.24,4.57 20.8,4.01 33.66,4.01 34.72,5.06 34.72,8.16 33.56,9.31 32.98,9.31 32.74,9.56 28.83,9.56 28.61,9.78 28.61,10.55 29.45,11.39 29.93,11.39 IC2.13
LASER
  Top 0.152: IC3.4 40.53,16.79 49.15,16.79 50.99,14.95 51.48,14.95 IC6.11
MISO
  Top 0.152: IC6.16 51.09,10.9 49.36,9.17 49.36,8.43 48.75,7.82 47.15,7.82 J4.1
MOSI
  Top 0.152: IC6.15 51.03,11.7 J4.4
N$1
  Top 0.152: IC1.1 26.21,23.62 27.34,24.75 31.77,24.75 32.84,23.68 33.71,23.68 D1.A
N$2
  Top 0.152: D4.A 33.08,16 32.27,15.18 25.58,15.18 24.77,15.99 IC1.7
N$3
  Top 0.152: D3.A 33.71,18.51 33.7,18.51 31.26,16.07 30.01,16.07 IC1.8
N$4
  Top 0.152: D2.A 33.72,21.2 31.31,23.61 30,23.61 IC1.14
N$5
  Top 0.152: D5.A 33.71,12.71 32.59,12.71 31.75,13.55 25.61,13.55 24.78,12.72 IC2.1
N$6
  Top 0.152: IC2.7 24.77,5.03 25.51,4.29 33.42,4.29 33.72,4.59 D8.A
N$7
  Top 0.152: D7.A 33.71,7.61 33.7,7.61 31.19,5.1 30,5.1 IC2.8
N$8
  Top 0.152: D6.A 33.72,10.69 31.77,12.64 30,12.64 IC2.14
N$9
  Top 0.254: R2.1 D7.C | R1.1 36.23,11.68 36.22,11.68
  Top 0.508: D1.C D4.C D3.C D2.C D5.C 36.22,11.68 D8.C D7.C D6.C
N$10
  Top 0.254: IC3.2 39.3,12.11 R1.2 C3.1
N$11
  Top 0.152: Q1.2 49.84,23.31 C13.2 51.25,21.54 52.24,20.55 52.24,19.02 52.42,18.84 53.36,18.84 53.8,18.39 IC6.7
N$12
  Top 0.152: D16.C 68.24,14.53 66.29,14.53 66.22,14.46 R24.1
N$13  (via drill 0.3)
  Top 0.152: 61.19,3.35 66.99,3.35 67.04,3.3 D17.A | IC6.24 59.6,8.4 59.6,6.14 61.05,4.7 61.05,3.52 61.19,3.37 61.19,3.35 | v76.07,6.5 75.02,6.5 69.01,0.49 62.17,0.49 60.98,1.68 60.98,3.07 61.19,3.28 61.19,3.35 | LED1.MP 92.62,18.86 92.34,18.86 90.59,20.61 90.59,23.68 92.48,25.57 93.46,25.57 94.23,26.33 94.23,27.17 94.51,27.45 96.74,27.45 98,26.19 98,15.79 98.98,14.81 98.98,10.9 98.63,10.55 98.07,10.55 97.23,9.71 82.08,9.71 79.64,7.26 v76.83,7.26
  Bottom 0.152: v76.07,6.5 v76.83,7.26
N$14
  Top 0.152: D15.C 68.24,24.59 66.22,24.59 R26.1
N$15
  Top 0.152: R21.1 92.55,28.29 89.48,28.29 87.24,26.05 RESET.P$4
N$16  (via drill 0.3, 0.35)
  Top 0.152: 69.29,12.5 68.31,12.5 D16.A | 69.29,12.5 74.11,17.32 74.11,18.02 74.46,18.37 78.58,18.37 78.72,18.51 90.46,18.51 92.62,16.34 LED0.MP | v58.4,10.48 57.84,9.92 57.84,9.43 IC6.23 | v69.36,12.14 69.36,12.43 69.29,12.5 | v69.4,11 69.1,11.3 v63.4,11.3
  Bottom 0.152: v69.36,12.14 69.36,11.04 v69.4,11 | v63.4,11.3 62.09,9.99 58.88,9.99 v58.4,10.48
N$17
  Top 0.152: IC6.8 52.76,17.99 51.25,19.5 C12.2 49.94,18.49 Q1.1
N$18
  Top 0.152: R23.2 95.21,26.4 BRES.MP
N$20  (via drill 0.3)
  Top 0.152: v99.47,25.36 99.47,26.19 95.69,29.97 91.22,29.97 89.55,31.64 80.08,31.64 72.26,23.82 67.61,23.82 67.2,23.4 67.2,21.43 66.93,21.16 60.83,21.16 58.5,18.83 58.24,18.83 57.92,18.51 57.92,18.11 IC6.2 | v98.7,24.59 98.7,15.51 99.26,14.95 99.26,10.76 98.49,9.99 v98.28,9.99 | v97.3,10.97 97.3,11.66 95.21,13.76 DUIT.MP
  Bottom 0.152: v98.7,24.59 v99.47,25.36 | v97.3,10.97 v98.28,9.99
N$21
  Top 0.152: D17.C 68.23,4.33 66.29,4.33 66.22,4.26 R25.1
N$22  (via drill 0.3)
  Top 0.152: 75.48,20.16 76.98,18.65 78.44,18.65 79.21,19.42 89.76,19.42 v90.39,20.05 | 75.48,20.16 73.14,22.49 68.31,22.49 D15.A | v91.15,20.82 92.13,20.82 92.62,21.3 LED2.MP | v62.52,11.97 64.92,11.97 65.3,11.6 69.64,11.6 69.91,11.86 69.91,12.7 74.67,17.46 v74.67,17.81 | 75.48,20.16 v73.9,18.58 | v61.25,10.8 61.14,10.9 IC6.25
  Bottom 0.152: v91.15,20.82 v90.39,20.05 | v62.52,11.97 62.42,11.97 v61.25,10.8 | v73.9,18.58 v74.67,17.81
N$23  (via drill 0.3)
  Top 0.152: v72.87,14.39 74.39,14.39 78.09,18.09 78.72,18.09 78.86,18.23 88.22,18.23 92.62,13.83 DIN.MP | IC6.1 58.6,18.54 59.91,19.85 65.5,19.85 v70.69,14.67
  Bottom 0.152: v72.87,14.39 71.17,14.39 70.89,14.67 v70.69,14.67
RESET
  Top 0.152: RESET.P$2 87.7,31 89.3,31 90.89,29.41 93.25,29.41 94.3,28.36 95.14,28.36 R23.1 95.28,28.36 95.9,27.73 96.88,27.73 98.28,26.33 98.28,25.77 99.54,24.52 99.54,10.48 98.49,9.43 82.28,9.43 79.56,6.71 76.62,6.71 76.28,7.05 74.74,7.05 72.57,9.22 64.01,9.22 61.05,12.18 61.05,13.62 60.57,14.1 IC6.29 56.38,14.1 52.43,10.16 52.43,8.02 J4.5 49.76,7.31 47.8,7.31 47.22,6.74 47.22,5.92 48.35,4.8 52.95,4.8 R29.1
SCK
  Top 0.152: IC6.17 53,6.88 51.29,5.17 49.36,5.17 J4.3
VCC  (via drill 0.3)
  Top 0.152: C11.1 55.33,19.78 | 55.33,19.78 56.2,18.9 IC6.4 56.2,18.95 C11.1 | 55.33,19.78 54.6,19.05 IC6.6 54.55,17.95 54.55,17.53 54.13,17.11 40.79,17.11 40.65,17.25 39.81,17.25 39.12,16.55 39.12,16.48 39.02,16.48 | C7.1 C11.1 | IC6.18 53.8,8.15 C6.1 54.34,7.54 54.34,5.52 C10.1 54.35,5.3 R29.2 55.22,2.37 47.71,2.37 44.33,5.74 44.33,7.52 45.61,8.8 J4.2 45.61,8.87 45.61,9.89 39.02,16.48 | POWER.3 7.33,7.61 POWER.3 | POWER.5 7.33,10.2 7.29,10.2 | POWER.7 7.33,12.71 7.29,12.71 | POWER.9 7.33,15.23 7.29,15.23 | POWER.11 7.33,17.81 7.29,17.81 | POWER.13 7.33,20.33 POWER.13 | R10.1 12.92,5.1 12.92,7.61 R9.1 12.92,7.68 12.92,10.13 R8.1 12.92,10.2 12.92,12.64 R7.1 12.92,12.71 12.92,15.23 R6.1 12.92,15.3 12.92,17.74 R5.1 12.92,17.81 12.92,20.26 R4.1 12.92,20.4 12.92,21.6 | v26.33,18.58 26.05,18.86 26.05,18.93 25.22,19.77 24.8,19.77 IC1.4 | 12.92,21.6 12.92,22.84 R3.1 12.99,22.91 14.18,24.1 20.33,24.1 21.37,23.05 26.07,23.05 | v26.33,7.68 26.33,7.75 25.22,8.87 24.8,8.87 IC2.4 | 39.02,16.48 38.42,16.48 IC3.5 38.35,22.98 36.9,24.42 35.59,24.42 34.29,23.12 32.95,23.12 31.65,24.42 27.45,24.42 26.07,23.05 | v27.31,9.99 27.31,11.8 28.78,13.27 31.57,13.27 32.65,12.2 34.2,12.2 34.23,12.22 34.37,12.22 34.37,14.53 34.92,15.09 34.92,19.21 34.51,19.63 34.16,19.63 33.11,20.68 33.11,20.89 30.94,23.05 26.07,23.05 | v27.31,20.95 27.31,21.81 26.07,23.05 | 7.29,21.6 12.92,21.6
  Top 0.508: C1.1 C8.1 7.55,23.12 POWER.15
  Top 1.27: VCC.MP POWER.15 7.29,21.6 POWER.13 7.29,17.81 POWER.11 POWER.9 7.29,15.23 7.29,12.71 POWER.7 7.29,10.2 POWER.5 POWER.3 POWER.1
  Bottom 0.152: v27.31,20.95 26.4,20.05 26.4,19.84 C2.1 26.33,19.77 v26.33,18.58 36.04,8.87 J4.2 | v26.33,7.68 26.33,8.87 C17.1 26.4,8.94 26.4,9.08 v27.31,9.99

### Text on the board
tPlace: 1 | 1
tNames: HEL Laser Centraal / (c) Kaya Hartwig 2019 | VCC GND | POS NEG | GND | GND | GND | GND | INDRINGER
tStop: HEL LASER